# EasyEDA Pro project ProProject_Quadrotor_Mk2.epro, board PCB1
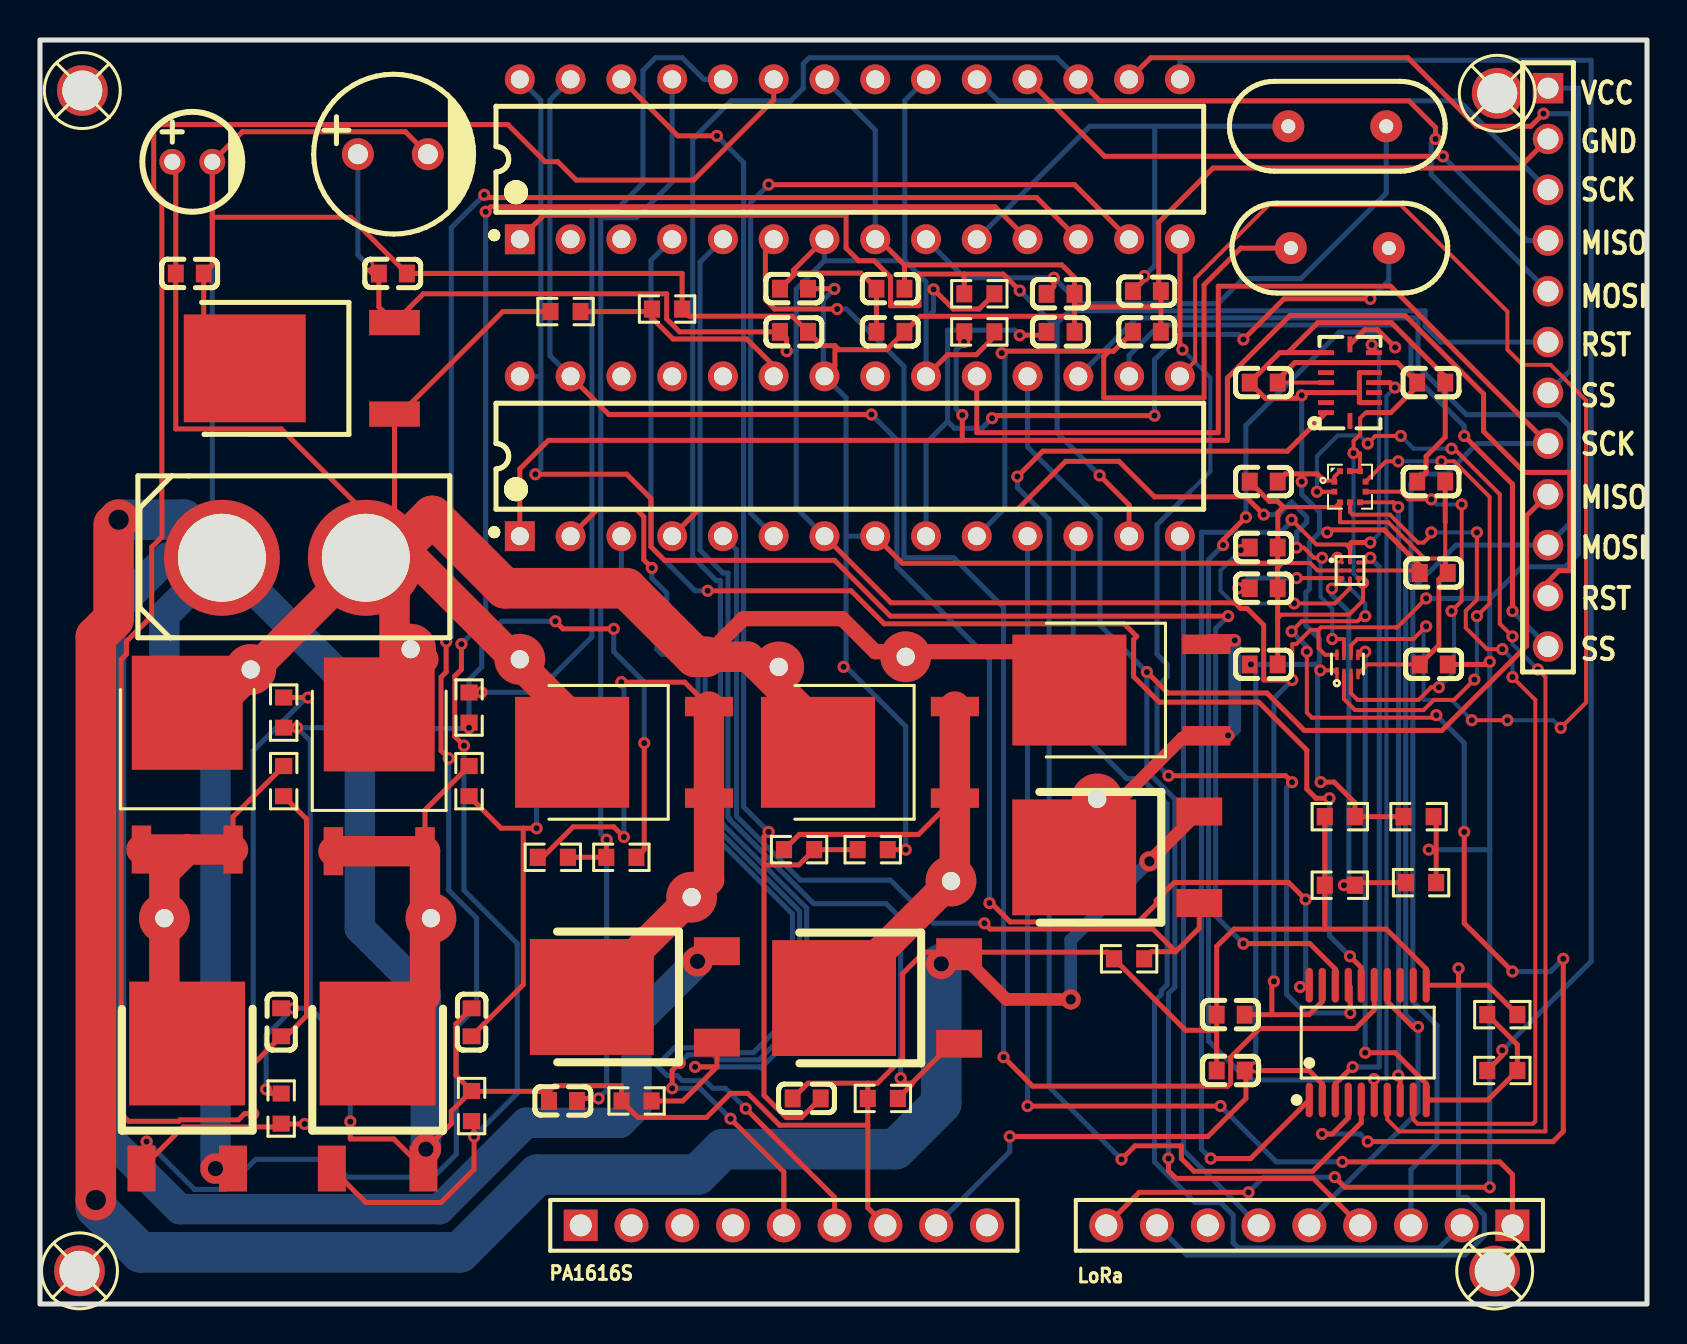
[diagram p3: board, top side]
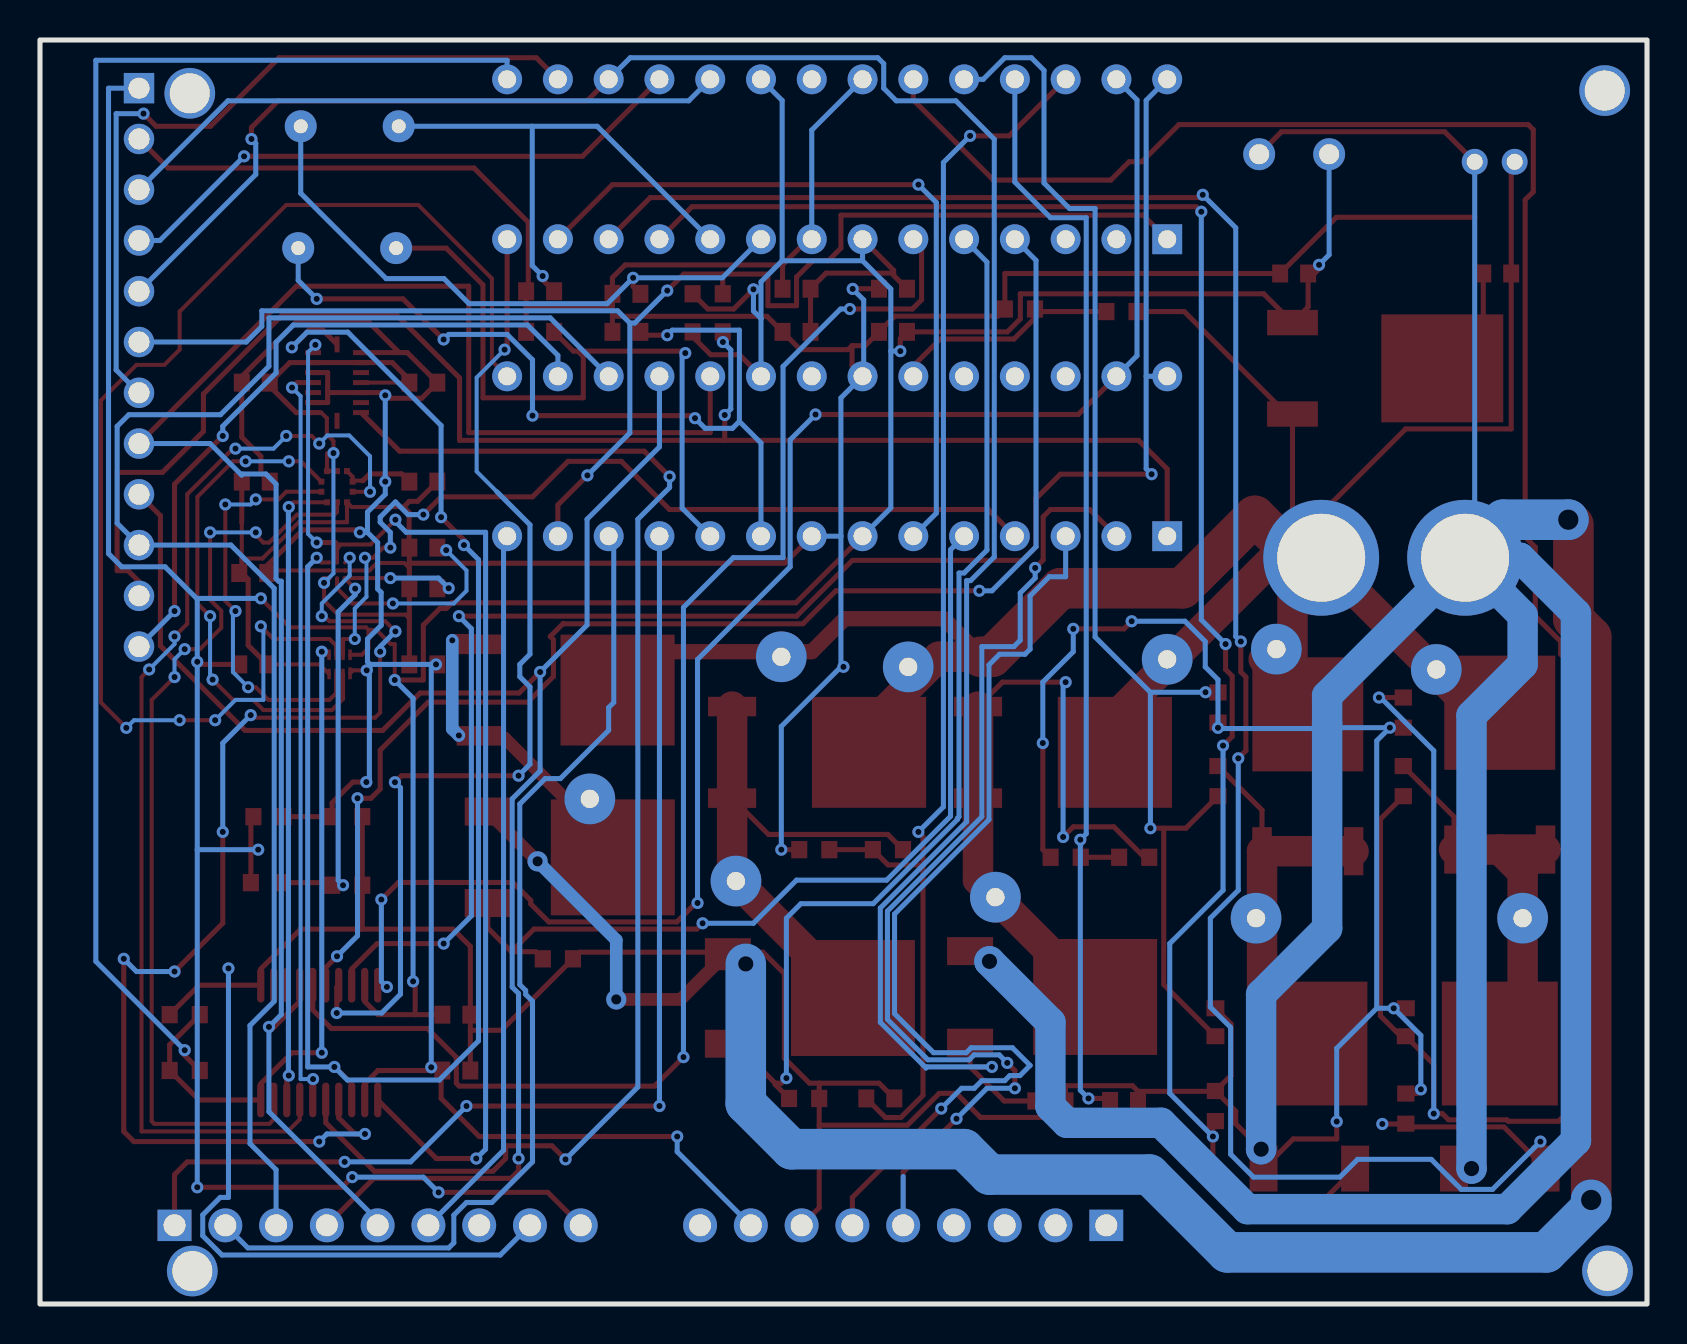
[diagram p4: board, bottom side, seen from below]

Outline 80.39 x 63.25 mm; copper layers: Top Layer, Bottom Layer. Coordinates in mm from the lower left corner of the outline.
Outline path: rectangle 0,63.25 80.39,0
Stack: Top Layer 0.035mm / Dielectric1 1.51mm FR4 er 4.5 / Bottom Layer 0.035mm

## Design rules (mm)
template: JLCPCB Capability(Two Layers Board)
spacing copperThickness1oz (default): track to track 0.102, other pairs 0.152 to 0.3
spacing copperThickness2oz: track to track 0.203, other pairs 0.152 to 0.3
track width copperThickness1oz (default): min 0.127, default 0.254, max 2.54
track width copperThickness2oz: min 0.203, default 0.254, max 2.54
differential pair differentialPair (default): width min 0.127, default 0.254, max 2.54; gap min 0.152, default 0.152
via viaSize (default): diameter min 0.5, default 0.61, max 10; hole min 0.3, default 0.305, max 6.3

## Placement (name value [footprint] x y rotation side)
5V_DC  100nF  [C0603]  17.65 51.56 0 top
12V_DC  100nF  [C0603]  7.49 51.56 0 top
BMI_DC1  100nF  [C0603]  69.6 46.1 0 top
BMI_DC2  100nF  [C0603]  61.21 46.1 0 top
BMM_CRST  2.2uF  [C0603]  61.21 37.85 0 top
BMM_DC1  100nF  [C0603]  61.21 35.81 0 top
BMM_DC2  100nF  [C0603]  69.72 36.58 0 top
C11  2.2uF  [CAP-TH_BD5.0-P2.00-D0.8-FD]  7.62 57.15 0 top
C14  100uF  [CAP-TH_BD8.0-P3.50-D0.6-FD]  17.65 57.53 0 top
C42  100nF  [C0603]  61.21 41.15 0 top
C43  100nF  [C0603]  69.6 41.15 0 top
C_LP1  100nF  [C0603]  12.07 14.1 270 top
C_LP2  100nF  [C0603]  21.59 14.1 270 top
C_LP3  100nF  [C0603]  26.16 10.16 0 top
C_LP4  100nF  [C0603]  38.35 10.29 0 top
D_1  MBR30100DT  [TO-252-2_L6.6-W6.1-P4.58-LS9.9-BR]  7.37 26.16 270 top
D_2  MBR30100DT  [TO-252-2_L6.6-W6.1-P4.58-LS9.9-BR]  16.97 26.08 270 top
D_3  MBR30100DT  [TO-252-2_L6.6-W6.1-P4.58-LS9.9-BR]  30.04 27.6 0 top
D_4  MBR30100DT  [TO-252-2_L6.6-W6.1-P4.58-LS9.9-BR]  42.34 27.6 0 top
D_5  MBR30100DT  [TO-252-2_L6.6-W6.1-P4.58-LS9.9-BR]  54.92 30.72 0 top
H1  -  [HDR-TH_12P-P2.54-V-M]  75.44 46.86 270 top
LoRa  -  [HDR-TH_9P-P2.54-V-F-1]  63.5 3.94 180 top
LS1_DC1  100nF  [C0603]  59.56 14.48 0 top
LS1_DC2  100nF  [C0603]  59.56 11.68 0 top
LS2_DC1  100nF  [C0603]  69.72 32 0 top
LS2_DC2  100nF  [C0603]  61.21 32 0 top
MCU1_DC1  100nF  [C0603]  37.72 50.8 0 top
MCU1_DC2  100nF  [C0603]  42.55 50.8 0 top
MCU1_RSTPU  10K  [R0603]  46.99 50.55 0 top
MCU2_DC1  100nF  [C0603]  37.72 48.64 0 top
MCU2_DC2  100nF  [C0603]  42.55 48.64 0 top
MCU2_RSTPU  10K  [R0603]  46.99 48.64 0 top
NOREF  -  [Pad_e655]  36.96 31.88 0 top
NOREF#2  -  [Pad_e205]  10.54 31.75 0 top
NOREF#3  -  [Pad_e184]  19.56 19.3 0 top
NOREF#4  -  [Pad_e1121]  43.31 32.39 0 top
NOREF#5  -  [Pad_e332]  32.6 20.36 0 top
NOREF#6  -  [Pad_e75]  18.54 32.77 0 top
NOREF#7  -  [Pad_e260]  24 32.26 0 top
NOREF#8  -  [Pad_e669]  45.58 21.16 0 top
NOREF#9  -  [Pad_e212]  6.22 19.3 0 top
NOREF#10  -  [Pad_e1122]  52.89 25.27 0 top
OCS1_C1  22pF  [C0603]  51.05 50.55 0 top
OCS1_C2  22pF  [C0603]  55.37 50.67 0 top
OCS2_C1  22pF  [C0603]  51.05 48.64 0 top
OCS2_C2  22pF  [C0603]  55.37 48.64 0 top
PA1616S  -  [HDR-TH_9P-P2.54-V-F-1]  37.21 3.94 0 top
R_PD1  10K  [R0603]  12.07 9.78 270 top
R_PD2  10K  [R0603]  21.59 9.91 270 top
R_PD3  10K  [R0603]  29.85 10.16 0 top
R_PD4  10K  [R0603]  42.16 10.29 0 top
R_PD5  10K  [R0603]  54.48 17.27 0 top
R_VD11  15K  [R0603]  12.19 26.16 270 top
R_VD12  10K  [R0603]  12.19 29.59 270 top
R_VD21  15K  [R0603]  21.46 26.16 270 top
R_VD22  10K  [R0603]  21.46 29.84 270 top
R_VD31  15K  [R0603]  25.65 22.35 0 top
R_VD32  10K  [R0603]  29.08 22.35 0 top
R_VD41  15K  [R0603]  37.97 22.73 0 top
R_VD42  10K  [R0603]  41.66 22.73 0 top
R_VD_BAT  20K  [R0603]  26.29 49.66 0 top
R_VD_BAT1  10K  [R0603]  31.37 49.78 0 top
SCREW1  -  [screw-hole-m2]  1.98 1.66 0 top
SCREW2  -  [screw-hole-m2]  72.9 60.58 0 top
SCREW3  -  [screw-hole-m2]  2.12 60.72 0 top
SCREW4  -  [screw-hole-m2]  72.77 1.65 0 top
T_1  IRLR2908TRPBF  [TO-252-3_L6.5-W6.1-P4.58-LS9.9-BR]  7.37 9.91 270 top
T_2  IRLR2908TRPBF  [TO-252-3_L6.5-W6.1-P4.58-LS9.9-BR]  16.89 9.91 270 top
T_3  IRLR2908TRPBF  [TO-252-3_L6.5-W6.1-P4.58-LS9.9-BR]  30.73 15.37 0 top
T_4  IRLR2908TRPBF  [TO-252-3_L6.5-W6.1-P4.58-LS9.9-BR]  42.85 15.31 0 top
T_5  IRLR2908TRPBF  [TO-252-3_L6.5-W6.1-P4.58-LS9.9-BR]  54.86 22.35 0 top
U1  MCU 1  [DIP-28_L34.6-W7.3-P2.54-LS10.2-BL]  40.51 57.28 0 top
U3  BMI088  [LGA-16_L4.5-W3.0-P0.50-BL]  65.53 46.1 0 top
U4  XT60  [CONN-TH_XT60]  12.7 37.34 0 top
U9  L7805CDT-TR  [TO-252-3_L6.5-W5.8-P4.58-BL]  13.99 46.82 90 top
U14  TXS0108EPWR  [TSSOP-20_L6.5-W4.4-P0.65-LS6.4-BL]  66.42 13.08 0 top
U15  BMM350  [WLCSP-9_L1.3-W1.3-R3-C3-P0.40-TL]  65.53 36.7 0 top
U16  MCU 2  [DIP-28_L34.6-W7.3-P2.54-LS10.2-BL]  40.51 42.42 0 top
U17  BMP390L  [LGA-10_L2.0-W2.0-P0.50-TL_BMP390L]  65.53 40.89 0 top
U18  TXS0102DQER  [X2SON-8_L1.4-W1.0-P0.35-BL]  65.41 32 0 top
VD_1.8_2  600  [R0603]  65.02 20.95 0 top
VD_1.8V_1  1K  [R0603]  69.09 21.08 0 top
VD_3.33V_1  1K  [R0603]  68.96 24.38 0 top
VD_3.33V_2  2K  [R0603]  65.02 24.38 0 top
VD_OE_1  1K  [R0603]  73.15 11.68 0 top
VD_OE_2  2K  [R0603]  73.15 14.48 0 top
X1  -  [OSC-TH_L10.0-W4.5-P5.00]  64.9 58.93 270 top
X2  -  [OSC-TH_L10.0-W4.5-P5.00]  65.02 52.83 270 top

## Footprints (pads in the part's own frame, mm; a bottom-side part is the same pattern mirrored in y, then rotated)
C0603
  rect 0.8x0.9 smd: 1(-0.7,0) 2(0.7,0)
CAP-TH_BD5.0-P2.00-D0.8-FD
  round 1.3 hole 0.8: 1(-1,0) 2(1,0)
CAP-TH_BD8.0-P3.50-D0.6-FD
  round 1.6 hole 1: 1(-1.75,0) 2(1.75,0)
CONN-TH_XT60
  round 5.8 hole 4.4: 1(-3.6,0) 2(3.6,0)
DIP-28_L34.6-W7.3-P2.54-LS10.2-BL
  rect 1.5x1.5 hole 0.9: 1(-16.51,-4)
  round 1.5 hole 0.9: 2(-13.97,-4) 3(-11.43,-4) 4(-8.89,-4) 5(-6.35,-4) 6(-3.81,-4) 7(-1.27,-4) 8(1.27,-4) 9(3.81,-4) 10(6.35,-4) 11(8.89,-4) 12(11.43,-4) 13(13.97,-4) 14(16.51,-4) 15(16.51,4) 16(13.97,4) 17(11.43,4) 18(8.89,4) 19(6.35,4) 20(3.81,4) 21(1.27,4) 22(-1.27,4) 23(-3.81,4) 24(-6.35,4) 25(-8.89,4) 26(-11.43,4) 27(-13.97,4) 28(-16.51,4)
HDR-TH_9P-P2.54-V-F-1
  rect 1.7x1.575 hole 1.1: 1(-10.16,0)
  round 1.7 hole 1.1: 2(-7.62,0) 3(-5.08,0) 4(-2.54,0) 5(0,0) 6(2.54,0) 7(5.08,0) 8(7.62,0) 9(10.16,0)
HDR-TH_12P-P2.54-V-M
  rect 1.524x1.524 hole 1.05: 1(-13.97,0)
  round 1.524 hole 1.05: 2(-11.43,0) 3(-8.89,0) 4(-6.35,0) 5(-3.81,0) 6(-1.27,0) 7(1.27,0) 8(3.81,0) 9(6.35,0) 10(8.89,0) 11(11.43,0) 12(13.97,0)
LGA-10_L2.0-W2.0-P0.50-TL_BMP390L
  rect 0.3x0.3 smd: 1(-0.78,0.25) 2(-0.78,-0.25) 3(-0.5,-0.78) 4(0,-0.78) 5(0.5,-0.78) 6(0.78,-0.25) 7(0.78,0.25) 8(0.5,0.78) 9(0,0.78) 10(-0.5,0.78)
LGA-16_L4.5-W3.0-P0.50-BL
  rect 0.8x0.25 smd: 1(-1.2,-1.498) 2(-1.2,-0.998) 3(-1.2,-0.498) 4(-1.2,0.002) 5(-1.2,0.502) 6(-1.2,1.002) 7(-1.2,1.502) 9(1.2,1.502) 10(1.2,1.002) 11(1.2,0.502) 12(1.2,0.002) 13(1.2,-0.498) 14(1.2,-0.998) 15(1.2,-1.498)
  rect 0.25x0.8 smd: 8(0,1.915) 16(0,-1.915)
OSC-TH_L10.0-W4.5-P5.00
  round 1.6 hole 0.7: 1(0,2.45) 2(0,-2.45)
Pad_e75
  round 2.54 hole 0.914: 29(0,0)
Pad_e184
  round 2.54 hole 0.914: 30(0,0)
Pad_e205
  round 2.54 hole 0.914: 31(0,0)
Pad_e212
  round 2.54 hole 0.914: 32(0,0)
Pad_e260
  round 2.54 hole 0.914: 33(0,0)
Pad_e332
  round 2.54 hole 0.914: 34(0,0)
Pad_e655
  round 2.54 hole 0.914: 35(0,0)
Pad_e669
  round 2.54 hole 0.914: 36(0,0)
Pad_e1121
  round 2.54 hole 0.914: 37(0,0)
Pad_e1122
  round 2.54 hole 0.914: 38(0,0)
R0603
  rect 0.806x0.864 smd: 1(-0.753,0) 2(0.753,0)
screw-hole-m2
  round 2.54 hole 2: 1(0,0)
TO-252-2_L6.6-W6.1-P4.58-LS9.9-BR
  rect 2.409x0.979 smd: 1(3.424,-2.29) 3(3.424,2.29)
  rect 5.711x5.548 smd: 2(-3.424,0)
TO-252-3_L6.5-W5.8-P4.58-BL
  rect 1.27x2.54 smd: 1(-2.288,-3.747) 3(2.288,-3.745)
  rect 5.4x6.1 smd: 2(-0.002,3.747)
TO-252-3_L6.5-W6.1-P4.58-LS9.9-BR
  rect 2.3x1.4 smd: 1(3.128,-2.29) 3(3.128,2.29)
  rect 6.2x5.8 smd: 2(-3.128,-0.004)
TSSOP-20_L6.5-W4.4-P0.65-LS6.4-BL
  oval 0.364x1.742 smd: 1(-2.925,-2.871) 2(-2.275,-2.871) 3(-1.625,-2.871) 4(-0.975,-2.871) 5(-0.325,-2.871) 6(0.325,-2.871) 7(0.975,-2.871) 8(1.625,-2.871) 9(2.275,-2.871) 10(2.925,-2.871) 11(2.925,2.871) 12(2.275,2.871) 13(1.625,2.871) 14(0.975,2.871) 15(0.325,2.871) 16(-0.325,2.871) 17(-0.975,2.871) 18(-1.625,2.871) 19(-2.275,2.871) 20(-2.925,2.871)
WLCSP-9_L1.3-W1.3-R3-C3-P0.40-TL
  round 0.2 smd: A1(-0.4,0.4) A2(0,0.4) A3(0.4,0.4) B1(-0.4,0) B2(0,0) B3(0.4,0) C1(-0.4,-0.4) C2(0,-0.4) C3(0.4,-0.4)
X2SON-8_L1.4-W1.0-P0.35-BL
  rect 0.175x0.6 smd: 1(-0.525,-0.445)
  rect 0.175x0.53 smd: 2(-0.175,-0.48) 3(0.175,-0.48) 4(0.525,-0.48) 5(0.525,0.48) 6(0.175,0.48) 7(-0.175,0.48) 8(-0.525,0.48)

## Nets
1.875V: BMM_DC1.1 U15.C1 VD_1.8_2.2 VD_1.8V_1.1
3.33V: BMI_DC1.2 BMI_DC2.1 BMM_DC2.1 C42.2 C43.1 LS1_DC2.2 LS2_DC2.1 PA1616S.8 U3.3 U3.7 U3.11 U3.14 U14.2 U15.B3 U17.1 U17.10 U18.1 VD_3.33V_1.1 VD_3.33V_2.2
5V: 5V_DC.1 C14.1 H1.1 LoRa.9 LS1_DC1.2 LS2_DC1.2 MCU1_DC1.1 MCU1_DC2.1 MCU1_RSTPU.2 MCU2_DC1.1 MCU2_DC2.1 MCU2_RSTPU.2 U1.7 U1.20 U9.3 U14.19 U16.7 U16.20 U18.8 VD_1.8V_1.2 VD_3.33V_1.2
12V: 12V_DC.1 C11.1 D_1.2 D_2.2 D_3.2 D_4.2 D_5.2 NOREF.35 NOREF#2.31 NOREF#4.37 NOREF#6.29 NOREF#7.33 R_VD_BAT.1 U4.2 U9.1
GND: 5V_DC.2 12V_DC.2 BMI_DC1.1 BMI_DC2.2 BMM_CRST.2 BMM_DC1.2 BMM_DC2.2 C11.2 C14.2 C42.1 C43.2 C_LP1.1 C_LP2.1 C_LP3.1 C_LP4.1 H1.2 LoRa.8 LS1_DC1.1 LS1_DC2.1 LS2_DC1.1 LS2_DC2.2 MCU1_DC1.2 MCU1_DC2.2 MCU2_DC1.2 MCU2_DC2.2 OCS1_C1.2 OCS1_C2.2 OCS2_C1.2 OCS2_C2.2 PA1616S.7 R_PD1.1 R_PD2.1 R_PD3.1 R_PD4.1 R_PD5.1 R_VD12.2 R_VD22.2 R_VD32.2 R_VD42.2 R_VD_BAT1.2 T_1.3 T_2.3 T_3.3 T_4.3 T_5.3 U1.8 U1.22 U3.4 U3.6 U3.10 U3.15 U4.1 U9.2 U14.11 U15.B1 U15.B2 U15.C3 U16.8 U16.22 U17.3 U17.8 U17.9 U18.4 VD_1.8_2.1 VD_3.33V_2.1 VD_OE_2.2
BEMF_1: C_LP1.2 R_VD11.2 R_VD12.1 U1.23
BEMF_2: C_LP2.2 R_VD21.2 R_VD22.1 U1.24
BEMF_3: C_LP3.2 R_VD31.2 R_VD32.1 U1.25
BEMF_4: C_LP4.2 R_VD41.2 R_VD42.1 U1.26
BMI_A_INT_3.33V: U3.1 U14.5
BMI_A_INT_5V: U1.4 U14.16
BMI_G_INT_3.33V: U3.12 U14.6
BMI_G_INT_5V: U1.6 U14.15
BMM_INT_3.33V: U14.4 U15.A1
BMM_INT_5V: U1.14 U14.17
BMP_CS_3.33V: U17.6 U18.3
BMP_CS_5V: U16.15 U18.6
BMP_INT_3.33V: U17.7 U18.2
BMP_INT_5V: U16.4 U18.7
LORA_CS: LoRa.2 U16.12
LORA_GO: LoRa.6 U16.14
LORA_RST: LoRa.1 U16.11
MCU2RX_GPSTX: PA1616S.5 U16.2
MCU2TX_GPSRX: PA1616S.6 U16.3
MISO_3.33V: U14.8 U17.5
MISO_MCU1: H1.4 U1.18
MISO_MCU2: H1.9 LoRa.4 U16.18
MOSI_3.33V: U14.9 U17.4
MOSI_MCU2: H1.10 LoRa.3 U16.17
OE_3.33V: U14.10 U18.5 VD_OE_1.2 VD_OE_2.1
OE_5V: U1.15 VD_OE_1.1
PWM_FAN: R_PD5.2 T_5.1 U16.5
PWM_T1: R_PD1.2 T_1.1 U1.12
PWM_T2: R_PD2.2 T_2.1 U1.11
PWM_T3/MOSI: H1.5 R_PD3.2 T_3.1 U1.17
PWM_T4: R_PD4.2 T_4.1 U1.5
RST_MCU1: H1.6 MCU1_RSTPU.1 U1.1 U16.13
RST_MCU2: H1.11 MCU2_RSTPU.1 U16.1
SCK_3.33V: U14.7 U17.2
SCK_MCU1: H1.3 U1.19
SCK_MCU2: H1.8 LoRa.5 U14.14 U16.19
SCL_3.33V: U3.8 U14.3 U15.A3
SCL_5V: U1.28 U14.18 U16.28
SDA_3.33V: U3.9 U14.1 U15.A2
SDA_5V: U1.27 U14.20 U16.27
SS_MCU1: H1.7 U1.16
SS_MCU2: H1.12 U16.16
START: U1.13 U16.6
VD_BATTERY: R_VD_BAT.2 R_VD_BAT1.1 U16.23
$1N565: D_1.1 D_1.3 NOREF#9.32 R_VD11.1 T_1.2
$1N1007: D_2.1 D_2.3 NOREF#3.30 R_VD21.1 T_2.2
$1N1195: D_3.1 D_3.3 NOREF#5.34 R_VD31.1 T_3.2
$1N1383: D_4.1 D_4.3 NOREF#8.36 R_VD41.1 T_4.2
$1N8442: OCS1_C2.1 U1.10 X1.2
$1N8453: OCS1_C1.1 U1.9 X1.1
$1N8901: OCS2_C2.1 U16.10 X2.2
$1N8903: OCS2_C1.1 U16.9 X2.1
$1N12852: BMM_CRST.1 U15.C2
$1N22123: D_5.1 D_5.3 NOREF#10.38 T_5.2

Pads without a net: LoRa 7; PA1616S 1 2 3 4 9; SCREW1 1; SCREW2 1; SCREW3 1; SCREW4 1; U1 2 3 21; U3 2 5 13 16; U14 12 13; U16 21 24 25 26

## Via types
v1: diameter 0.61, hole 0.305, Top Layer to Bottom Layer, 162 vias
v2: diameter 1.016, hole 0.508, Top Layer to Bottom Layer, 2 vias
v3: diameter 1.524, hole 0.762, Top Layer to Bottom Layer, 4 vias
v4: diameter 2.032, hole 1.016, Top Layer to Bottom Layer, 2 vias

## Routing (per net, layer and track width the routed paths; a pad name or vN(x,y) marks a point on that pad's centre or on a via; arc(x,y) is an arc through that point)
1.875V: length 25.1
  Top Layer w0.203: v1(62.86,36.32) 65.09,36.32 65.12,36.29 v1(64.63,35.8)
  Top Layer w0.254: 65.13,36.3 65.12,36.3 65.12,36.29 ; v1(59.95,35.81) 60.51,35.81 ; VD_1.8V_1.1 65.9,21.08 VD_1.8_2.2 v1(65.23,20.95)
  Bottom Layer w0.254: v1(64.63,35.8) 64.63,35.48 65.48,34.63 65.48,21.2 v1(65.23,20.95) ; v1(62.86,36.32) 60.45,36.32 v1(59.95,35.81)
3.33V: length 117.3
  Top Layer w0.203: U17.10 64.75,41.39 U17.1 64.7,41.2 64.26,41.2 ; 69.02,36.7 U15.B3 ; v1(64.05,31.71) 64.73,31.71 U18.1
  Top Layer w0.254: 62.42,47.6 62.02,47.6 60.51,46.1 61.3,45.32 62.84,45.32 63.12,45.6 ; 62.42,47.6 63.92,49.1 67.6,49.1 70.3,46.41 BMI_DC1.2 70.3,43.37 69.34,42.42 69.34,41.59 C43.1 ; 62.42,47.6 U3.7 ; 60.82,11.68 63.48,11.68 64.15,11.02 U14.2 ; 60.82,11.68 v1(60.82,11.84) ; 60.82,11.68 LS1_DC2.2 60.33,11.62 60.33,10.29 58.42,8.38 v1(48.51,8.38) ; C42.2 62.3,41.53 63.89,41.53 64.23,41.2 64.26,41.2 ; v1(64.07,26.12) 64.74,26.12 65.78,25.08 VD_3.33V_2.2 VD_3.33V_1.1 ; v1(63.12,45.47) 63.12,45.6 ; 63.12,45.6 63.12,45.6 U3.3 66,45.6 ; 66,45.6 66,45.1 66.73,45.1 ; 66,45.6 66,46.6 66.73,46.6 ; BMM_DC2.1 69.02,36.95 67.24,38.73 64.52,38.73 v1(64.39,38.61) ; v1(60.58,32) 60.51,32
  Bottom Layer w0.254: v1(64.39,38.61) 64.01,38.61 ; 64.01,38.61 64.01,39.62 63.12,40.51 v1(63.12,41.15) v1(63.12,45.47) ; 64.01,38.61 63.5,38.1 63.5,35.78 63.32,35.6 63.32,33.96 64.01,33.27 64.01,32.13 63.88,32 ; 63.88,32 63.88,31.74 63.91,31.71 ; 63.88,32 60.82,32 ; 60.82,32 v1(60.82,11.84) ; 60.82,32 v1(60.58,32) ; v1(48.51,8.38) 48.51,7.62 PA1616S.8 ; v1(64.07,26.12) 63.91,26.27 63.91,31.71 ; v1(64.05,31.71) 63.91,31.71
5V: length 241.9
  Top Layer w0.203: 63.96,33.73 63.96,32.82 64.29,32.48 64.88,32.48 ; 63.96,33.73 63.56,33.73 62.85,33.02 62.64,33.02 v1(62.64,31.22) ; 63.96,33.73 64.08,33.86 67.86,33.86 67.88,33.84 v1(69.34,35.31)
  Top Layer w0.254: v1(62.64,31.22) 61.21,31.22 61.21,33.97 60.39,34.8 60.07,34.8 59.78,35.09 42.57,35.09 U16.7 ; v1(16.41,51.99) 16.41,51.79 16.95,51.24 ; MCU1_DC1.1 37.69,51.47 37.69,51.58 ; v1(60.45,5.59) 54.99,5.59 LoRa.9 ; 37.69,51.58 41.06,51.58 MCU1_DC2.1 MCU2_DC2.1 ; 37.69,51.58 37.69,51.72 U1.7 ; 61.62,14.48 LS1_DC1.2 ; 61.62,14.48 61.62,16.04 v1(61.73,16.14) ; 61.62,14.48 63.48,14.48 64.15,15.14 U14.19 ; MCU1_RSTPU.2 46.98,49.78 45.69,49.78 v1(44.7,50.77) ; MCU2_RSTPU.2 47.74,48.4 46.84,47.5 45.4,47.5 U16.20 ; v1(72.52,32.13) 72.39,32 LS2_DC1.2 ; 69.84,22.73 VD_1.8V_1.2 ; 69.84,22.73 v1(69.47,22.73) ; 69.84,22.73 69.84,24.26 VD_3.33V_1.2 ; 16.95,51.24 16.95,49.89 U9.3 19.18,50.55 31.35,50.55 31.35,49.29 32,48.64 MCU2_DC1.1 37.35,48.31 v1(37.35,47.68) ; 16.95,51.24 5V_DC.1 ; v1(64.77,6.35) 65.28,5.84 v1(72.52,5.84)
  Bottom Layer w0.254: 39.24,52.2 37.83,50.79 37.83,47.68 ; 39.24,52.2 43.26,52.2 ; 39.24,52.2 U1.7 ; 37.83,47.68 v1(37.35,47.68) ; 37.83,47.68 37.83,39.83 U16.7 ; v1(60.45,5.59) 61.21,6.35 v1(64.77,6.35) ; 44.32,49.31 44.32,51.14 43.26,52.2 ; 44.32,49.31 44.7,49.69 v1(44.7,50.77) ; 44.32,49.31 U16.20 ; 43.26,52.2 43.26,60.22 U1.20 ; 72.52,22.73 v1(72.52,32.13) 72.52,35.28 ; 72.52,22.73 v1(69.47,22.73) ; 72.52,22.73 v1(72.52,5.84) ; 72.52,35.28 74.13,36.89 76.3,36.89 76.96,37.55 76.96,60.83 H1.1 ; 72.52,35.28 72.49,35.31 v1(69.34,35.31) ; C14.1 15.9,52.5 v1(16.41,51.99) ; v1(61.73,16.14) 61.73,30.3 v1(62.64,31.22)
12V: length 130.1
  Top Layer w0.254: 17.74,44.24 U9.1 ; 17.74,44.24 23.15,49.66 R_VD_BAT.1 ; 17.74,44.24 17.74,37.34 ; 17.35,38.39 17.35,38.5 12.07,43.78 6.79,43.78 12V_DC.1 6.79,56.98 C11.1
  Top Layer w0.762: 33.33,32.39 33.33,32.44 35.18,34.29 40.13,34.29 41.78,32.64 49.58,32.64 D_5.2
  Top Layer w1.524: D_2.2 17.74,30.27 17.74,30.31 ; 17.74,37.34 18.67,37.34 26.62,29.39 D_3.2 ; 17.74,37.34 16.3,37.34 8.55,29.59 D_1.2 ; 17.74,37.34 17.74,30.31 ; 17.74,30.31 18.67,31.24 18.42,31.5 19.18,32.26 ; D_4.2 38.92,28.9 35.43,32.39 33.33,32.39
  Top Layer w2.032: 17.74,37.55 19.62,39.43 23.24,35.81 29.34,35.81 32.77,32.39 33.33,32.39
GND: length 714.7
  Top Layer w0.203: v1(66.18,36.08) 66.18,35.19 65.48,34.49 62.11,34.49 61.91,34.3 ; U15.B2 63.91,36.7 63.54,37.08 62.17,37.08 61.91,36.82 ; U17.9 U17.8 66.03,42.58 ; 66.73,44.6 66.32,44.6 66.04,44.32 66.04,43.51 65.71,43.18 v1(65.71,42.58) ; 62.2,39.88 64.8,39.88 U17.3 65.03,39.12 67.45,39.12 69.26,37.3 70.3,37.3 70.3,39.12 ; LS2_DC1.1 66.41,32 U18.4 ; 61.91,46.25 62.06,46.1 U3.4 ; 61.91,39.51 61.92,39.52
  Top Layer w0.254: R_PD2.1 20.57,9.64 20.57,9.02 v3(19.3,7.75) ; R_PD2.1 20.81,11.44 20.81,14.02 C_LP2.1 ; R_PD2.1 21.61,10.64 25.46,10.64 ; VD_3.33V_2.1 VD_1.8_2.1 64.27,18.76 ; 58.86,13.7 LS1_DC1.1 58.86,17.89 59.73,18.76 64.27,18.76 ; 58.86,13.7 57.3,13.7 R_PD5.1 53.4,17.6 T_4.3 44.23,17.6 43.15,16.53 43.15,12.31 41.9,11.05 41.41,11.05 ; 58.86,13.7 LS1_DC2.1 ; v1(30.23,28.07) 30.23,22.74 R_VD32.2 ; 43.25,51.99 41.96,53.28 U1.8 ; 43.25,51.99 51.12,51.99 51.75,51.35 OCS1_C1.2 51.75,49.89 ; 43.25,51.99 MCU1_DC2.2 ; 70.3,36.58 BMM_DC2.2 ; 70.3,36.58 70.3,37.3 ; 70.3,36.58 69.98,36.26 69.98,32.96 LS2_DC1.1 ; PA1616S.7 41.41,4.82 41.41,8.95 ; 41.41,8.95 R_PD4.1 41.41,11.05 ; 41.41,8.95 37,8.95 35.41,10.54 34.54,10.54 33.34,9.34 29.91,9.34 R_PD3.1 29.09,10.92 25.74,10.92 25.46,10.64 ; 61.91,37.06 BMM_DC1.2 LS2_DC2.2 ; 61.91,37.06 43.14,37.06 U16.8 ; 61.91,37.06 BMM_CRST.2 61.92,37.86 61.92,39.5 61.91,39.51 ; 51.75,49.42 OCS2_C1.2 ; 51.75,49.42 51.75,49.89 ; 51.75,49.42 44.03,49.42 MCU2_DC2.2 42.36,47.75 39.97,47.75 39.77,47.95 ; U9.2 8.19,48.86 12V_DC.2 8.62,51.99 8.62,54.37 ; C43.2 70.3,39.12 ; 41.41,11.05 38.42,11.05 C_LP4.1 ; 25.46,10.16 25.46,10.64 ; v1(25.78,34.16) 26.16,33.78 v1(28.7,33.78) ; 64.27,18.76 67.35,18.76 69.35,16.76 U14.11 70.96,15.95 ; v1(39.74,50.79) 39.73,50.8 MCU1_DC1.2 ; T_2.3 17.7,8.26 15.52,8.26 v1(15.52,9.13) ; 56.07,48.64 56.07,49.89 ; 56.07,49.89 51.75,49.89 ; 56.07,49.89 56.07,50.67 55.96,50.78 55.96,54.12 58.68,56.84 73.99,56.84 H1.2 ; 39.77,47.95 39.11,47.95 MCU2_DC1.2 37.63,49.43 32.48,49.43 R_VD_BAT1.2 32.12,51.56 5V_DC.2 15.54,54.37 8.62,54.37 ; 39.77,47.95 39.77,46.94 U16.22 ; v1(43.31,22.73) R_VD42.2 ; 8.62,54.37 C11.2 10.13,58.66 18.28,58.66 C14.2 ; C_LP1.1 v1(12.67,14.8) ; 60.51,41.15 61.5,40.16 61.91,40.16 62.2,39.88 61.92,39.6 61.92,39.52 ; 70.96,15.95 v1(70.96,16.79) ; 70.96,15.95 72.43,15.95 VD_OE_2.2 ; v1(12.86,28.84) R_VD12.2 ; v1(66.18,36.08) 66.18,36.3 U15.C3 ; v1(11.31,10.74) 11.52,10.53 R_PD1.1 ; 66.73,44.6 67.58,44.6 68.9,45.92 BMI_DC1.1 67.89,47.1 U3.6 62.77,47.1 61.91,46.25 BMI_DC2.2
  Top Layer w0.635: v3(45.08,17.02) 46.57,17.02 48.34,15.24 v2(51.56,15.24) ; T_5.3 v2(55.5,22.15)
  Top Layer w2.032: v4(2.79,5.21) 2.79,33.38 3.68,34.27 3.68,38.99
  Bottom Layer w0.203: v1(65.71,42.58) 65.71,36.55 v1(66.18,36.08)
  Bottom Layer w0.254: v1(25.78,34.16) 23.11,34.16 22.1,33.15 22.1,31.88 21.46,31.24 v1(21.46,28.83) 21.43,28.8 16,28.8 ; v1(43.31,22.73) 43.31,28.9 40.32,31.88 ; U1.8 41.78,58.74 U1.22 ; LoRa.8 57.36,2.45 71.29,2.45 72.25,3.42 72.25,4.46 71.37,5.33 70.96,5.33 v1(70.96,16.79) ; 13.52,14.8 15.52,12.8 v1(15.52,9.13) ; 13.52,14.8 13.52,28.18 v1(12.86,28.84) 15.8,28.84 16,29.03 ; 13.52,14.8 v1(12.67,14.8) 11.31,13.44 v1(11.31,10.74) ; U4.1 8.62,37.82 C11.2 ; v1(28.7,33.78) 28.7,32.64 30.23,31.11 v1(30.23,28.07) ; 40.32,31.88 40.32,38.42 ; 40.32,31.88 v1(40.2,31.88) ; 40.32,38.42 40.32,45.34 U16.22 39.19,46.48 39.19,50.24 v1(39.74,50.79) ; 40.32,38.42 U16.8
  Bottom Layer w0.635: v2(55.5,22.15) 51.56,18.21 v2(51.56,15.24)
  Bottom Layer w1.524: U4.1 6.35,37.34 3.56,34.54 3.56,8.18 6.99,4.75 19.99,4.75 24.31,9.07 29.02,9.07 29.85,9.89 29.85,14.1 v3(32.89,17.14) ; U4.1 16,30.44 16,18.8 19.3,15.49 v3(19.3,7.75) ; U4.1 6.22,34.46 6.22,32 8.78,29.45 v3(8.78,6.78)
  Bottom Layer w2.032: v3(45.08,17.02) 45.08,10.03 42.8,7.75 34.16,7.75 32.89,6.48 24.89,6.48 21,2.59 5.03,2.59 2.79,4.83 v4(2.79,5.21) ; v4(3.94,39.24) 7.2,39.24 8.62,37.82
BEMF_1: length 133
  Top Layer w0.254: U1.23 36.7,60.25 32.69,56.24 26.82,56.24 25.9,57.15 25.27,57.15 23.41,59.01 5.94,59.01 5.69,58.76 5.69,55.65 6.1,55.25 6.1,38.38 5.59,37.87 5.59,34.42 4.32,33.15 4.32,32.52 4.06,32.26 4.06,9.52 4.44,9.14 6.94,9.14 7.01,9.22 9.93,9.22 10.24,9.53 v1(10.67,9.53) 10.67,12 C_LP1.2 12.31,13.4 13.34,14.42 13.34,24.27 R_VD11.2 ; v1(13.41,30.34) R_VD12.1
  Bottom Layer w0.254: v1(13.41,30.34) 13.33,30.34 10.67,27.68 v1(10.67,9.53)
BEMF_2: length 64.5
  Top Layer w0.254: 24.17,23.81 24.17,15.98 C_LP2.2 ; 24.17,23.81 v1(24.84,23.81) ; 24.17,23.81 23.07,23.81 R_VD21.2 ; v1(22.09,30.61) 21.47,30.61 R_VD22.1
  Bottom Layer w0.254: v1(24.84,23.81) 24.84,30.61 ; 24.84,30.61 27.61,33.38 27.61,54.81 28.89,54.81 30.16,56.09 30.16,61.72 30.8,62.36 32.13,62.36 33.21,61.28 U1.24 ; 24.84,30.61 v1(22.09,30.61)
BEMF_3: length 57.7
  Top Layer w0.254: C_LP3.2 26.99,10.29 v1(27.94,10.29) ; R_VD31.2 R_VD32.1 28.33,23.21 v1(28.35,23.23)
  Bottom Layer w0.254: U1.25 31.62,56.14 29.84,54.35 28.05,54.35 28.05,23.53 v1(28.35,23.23) 28.35,10.7 v1(27.94,10.29)
BEMF_4: length 63.8
  Top Layer w0.254: U1.26 31.91,58.45 v1(33.86,58.45) ; C_LP4.2 38.1,9.33 37.33,9.33 36.22,10.44 36.22,21.97 ; 36.22,21.97 37.96,21.97 R_VD41.2 R_VD42.1 ; 36.22,21.97 36.22,23.39 v1(36.45,23.62)
  Bottom Layer w0.254: v1(33.86,58.45) 35.2,57.11 35.2,24.87 v1(36.45,23.62)
BMI_A_INT_3.33V: length 68.4
  Top Layer w0.254: v1(48.89,41.4) 50.17,42.67 62.4,42.67 U3.1 ; v1(54.1,7.24) 54.78,7.92 57.1,7.92 57.1,7.28 57.73,6.64 63.67,6.64 66.1,9.07 U14.5
  Bottom Layer w0.254: v1(54.1,7.24) 50.48,10.86 50.48,39.26 48.89,40.85 v1(48.89,41.4)
BMI_A_INT_5V: length 67.5
  Top Layer w0.254: v1(64.51,25.31) 63.83,25.31 63.37,25.77 63.37,27.71 60.97,30.11 55.99,30.11 54.71,31.4 54.71,33.24 54.86,33.4 54.21,34.06 54.19,34.04 42.23,34.04 40.58,35.69 v1(33.4,35.69) ; U14.16 66.1,16.83 v1(65.53,17.4)
  Bottom Layer w0.254: v1(33.4,35.69) 32.77,35.69 30.56,37.89 30.56,52.22 U1.4 ; v1(64.51,25.31) 64.51,18.42 v1(65.53,17.4)
BMI_G_INT_3.33V: length 37.6
  Top Layer w0.254: 66.73,46.1 67.53,46.1 v1(67.78,45.85) ; v1(66.73,11.26) 66.75,11.24 U14.6
  Bottom Layer w0.203: v1(67.78,45.85) 67.36,45.43 67.36,11.26 v1(66.73,11.26)
BMI_G_INT_5V: length 72.3
  Top Layer w0.254: U1.6 36.29,52.86 36.29,50.25 36.75,49.78 v1(39.88,49.78) ; U14.15 66.75,14.72 65.82,13.79 61.01,13.79 59.56,12.35 59.56,11.05 59.42,10.9 49.65,10.9 v1(48.2,12.35)
  Bottom Layer w0.254: v1(39.88,49.78) 40.34,49.78 43.22,46.91 43.22,37.34 45.71,37.34 48.2,34.85 v1(48.2,12.35)
BMM_INT_3.33V: length 59.3
  Top Layer w0.203: v1(62.61,33.66) 63.12,34.16 65.91,34.16 66.17,34.42 v1(66.29,34.42) ; v1(69.85,29.46) 69.72,29.34 63.63,29.34 63.37,29.59 v1(63.37,32.64)
  Top Layer w0.254: v1(64.14,8.51) 64.64,8.51 65.45,9.31 U14.4 ; v1(73.66,16.64) 71.25,19.05 v1(71.25,23.62) ; v1(76.2,17.27) 76.2,8.64 75.69,8.13 v1(66.42,8.13)
  Bottom Layer w0.203: v1(64.9,37.34) 64.9,36.45 66.29,35.05 v1(66.29,34.42)
  Bottom Layer w0.254: v1(63.37,32.64) 63.37,32.89 v1(62.61,33.66) ; v1(73.66,16.64) 75.57,16.64 v1(76.2,17.27) ; v1(64.14,8.51) 66.04,8.51 v1(66.42,8.13) ; v1(69.85,29.46) 71.25,28.07 v1(71.25,23.62)
BMM_INT_5V: length 51.3
  Top Layer w0.254: v1(57.15,47.75) 57.15,47.88 57.02,48.01 U1.14 ; v1(56.45,26.43) 62.31,26.43 v1(62.63,26.11) ; U14.17 65.55,15.85 v1(65.55,14.56)
  Bottom Layer w0.203: 57.53,40.64 58.55,41.66 58.55,46.36 v1(57.15,47.75)
  Bottom Layer w0.254: v1(65.55,14.56) 63.3,14.56 62.36,15.5 62.36,25.83 v1(62.63,26.11) ; 57.53,40.64 55.88,38.99 55.88,32.51 56.39,32 56.39,31.39 55.88,30.88 55.88,27 v1(56.45,26.43)
BMP_CS_3.33V: length 20.4
  Top Layer w0.203: v1(71.12,40) 71.12,35.18 v1(70.61,34.67) ; v1(69.98,30.86) 69.6,30.86 68.96,30.23 65.91,30.23 65.58,30.56 U18.3 ; v1(69.6,40.26) 68.45,40.26 68.07,40.64 U17.6
  Bottom Layer w0.203: 70.74,34.54 70.74,31.62 v1(69.98,30.86) ; v1(69.6,40.26) 69.85,40 v1(71.12,40)
BMP_CS_5V: length 64.2
  Top Layer w0.203: U16.15 57.79,47.18 57.79,51.31 61.47,54.99 68.07,54.99 73.41,49.66 73.41,47.75 74.17,46.99 75.57,46.99 77.34,45.21 77.34,30.1 v1(76.07,28.83) ; v1(73.41,29.21) v1(71.63,29.21) ; v1(69.34,33.91) 68.71,33.27 65.91,33.27 65.58,32.95 65.58,32.48
  Bottom Layer w0.203: v1(76.07,28.83) 75.69,29.21 v1(73.41,29.21) ; v1(69.34,33.91) 69.22,33.78 69.22,30.23 70.61,30.23 v1(71.63,29.21)
BMP_INT_3.33V: length 25.5
  Top Layer w0.203: v1(71.88,34.42) 72.52,35.05 72.52,40.39 70.74,42.16 v1(70.1,42.16) ; v1(71.76,31.24) 70.74,30.23 69.72,30.23 69.22,29.72 65.79,29.72 65.23,30.27 U18.2 ; U17.7 67.33,42.16 v1(67.95,42.16)
  Bottom Layer w0.203: v1(71.88,34.42) 71.88,31.37 v1(71.76,31.24) ; v1(70.1,42.16) v1(67.95,42.16)
BMP_INT_5V: length 43.9
  Top Layer w0.203: v1(64.14,37.34) 63.73,37.34 63.22,37.85 v1(62.86,37.85) ; 65.23,32.48 65.23,33.27 v1(64.64,33.27)
  Top Layer w0.254: v1(61.21,39.5) 60.33,40.39 55.75,40.39 53.98,42.16 51.31,42.16 48.89,39.75 32.96,39.75 U16.4
  Bottom Layer w0.203: v1(64.64,33.27) 64.64,34.8 64.06,35.38 64.06,37.26 v1(64.14,37.34)
  Bottom Layer w0.254: v1(61.21,39.5) 61.98,39.5 62.61,40.13 63.37,39.37 63.37,39.12 62.86,38.61 v1(62.86,37.85)
LORA_CS: length 52.1
  Bottom Layer w0.254: U16.12 51.69,38.16 51.69,30.1 51.94,29.84 51.94,28.71 54.36,26.29 55.12,26.29 56.39,25.02 56.39,15.98 56.1,15.69 56.1,15.49 55.75,15.15 55.75,7.11 57.79,5.08 59.05,5.08 59.69,4.44 59.69,3.06 59.94,2.81 69.99,2.81 70.87,3.69
LORA_GO: length 36.1
  Bottom Layer w0.254: LoRa.6 57.2,7.69 57.2,38.24 U16.14
LORA_RST: length 56.7
  Top Layer w0.254: v1(65.15,7.11) 73.03,7.11 73.66,6.48 LoRa.1 ; v1(49.4,9.91) v1(59.05,9.91)
  Bottom Layer w0.254: v1(49.4,9.91) U16.11 ; v1(59.05,9.91) 61.85,7.11 v1(65.15,7.11)
MCU2RX_GPSTX: length 54.5
  Top Layer w0.254: PA1616S.5 37.21,6.6 v1(34.54,9.27) ; U16.2 27.88,39.75 29.85,39.75 30.21,39.39 30.21,37.23 v1(30.61,36.83) ; v1(32,12.06) 31.62,11.68 v1(31.62,10.8)
  Bottom Layer w0.254: 37.21,6.38 PA1616S.5 ; v1(32,12.06) 32.41,12.47 33.66,12.47 33.91,12.22 35.97,12.22 38,14.24 38,19.66 33.27,24.38 33.27,32.89 31.67,32.89 31.35,33.21 31.35,35.58 30.61,36.32 30.61,36.7 ; v1(34.54,9.27) 33.02,10.8 v1(31.62,10.8)
MCU2TX_GPSRX: length 49.7
  Top Layer w0.254: v1(35.31,9.78) 39.75,5.33 PA1616S.6
  Bottom Layer w0.254: U16.3 29.08,36.39 29.9,36.39 30.86,35.43 30.86,32.77 31.11,32.51 32.39,32.51 32.92,31.98 32.92,24.24 37.64,19.51 37.64,14.53 35.69,12.58 34.06,12.58 33.81,12.82 31.75,12.82 30.86,11.94 31.37,11.43 31.88,11.43 32.13,11.18 33.27,11.18 33.66,10.8 34.29,10.8 v1(35.31,9.78)
MISO_3.33V: length 31.7
  Top Layer w0.203: U17.5 67.71,40.11 v1(67.95,39.88)
  Top Layer w0.254: U14.8 68.05,11.33 v1(67.95,11.43)
  Bottom Layer w0.254: v1(67.95,39.88) 67.96,39.86 67.96,11.45 v1(67.95,11.43)
MISO_MCU1: length 29.4
  Top Layer w0.254: U1.18 53.25,57.43 v1(70.18,57.43)
  Bottom Layer w0.254: H1.4 74.39,53.21 v1(70.18,57.43)
MISO_MCU2: length 83.6
  Top Layer w0.254: v1(56.45,7.28) 56.45,6.67 56.83,6.29 63.69,6.29 LoRa.4 ; v1(55.37,31.62) 56.42,30.57 61.38,30.57 63.25,28.7 70.14,28.7 74.37,32.93 74.37,39.44 H1.9
  Bottom Layer w0.254: v1(56.45,7.28) 56.45,15.54 56.77,15.86 56.77,25.27 55.37,26.67 v1(55.37,31.62) 53.02,33.97 53.02,39.26 49.4,42.89 U16.18
MOSI_3.33V: length 46.6
  Top Layer w0.203: v1(73.15,32.77) 72.39,32.77 71.32,33.83 71.32,34.68 71.88,35.24 v1(71.88,38.61) ; U17.4 65.53,39.62 65.66,39.5 67.53,39.5 68.93,38.1 69.22,38.1 69.6,38.48 v1(69.6,38.61) ; U14.9 68.7,9.24 68.92,9.02 74.68,9.02 74.8,9.14 74.8,30.23 v1(73.66,31.37)
  Bottom Layer w0.203: v1(73.15,32.77) 73.66,32.26 v1(73.66,31.37) ; v1(69.6,38.61) v1(71.88,38.61)
MOSI_MCU2: length 76.4
  Bottom Layer w0.254: U16.17 54.86,49.34 68.94,49.34 68.94,46.92 71.36,44.5 75.95,44.5 76.53,43.91 76.53,39.07 H1.10 70.84,37.97 68.67,35.81 68.67,15.14 69.89,13.94 69.89,8.03 68.58,6.72 LoRa.3
OE_3.33V: length 33.6
  Top Layer w0.203: v1(66.29,32.64) 66.14,32.48 65.93,32.48
  Top Layer w0.254: VD_OE_2.1 73.91,12.97 VD_OE_1.2 72.43,10.21 U14.10 69.35,11.02 67.79,12.57 v1(66.29,12.57)
  Bottom Layer w0.254: v1(66.29,32.64) v1(66.29,12.57)
OE_5V: length 74.2
  Top Layer w0.254: v1(73.15,12.7) 73.15,12.44 VD_OE_1.1
  Bottom Layer w0.254: U1.15 57.02,62.23 77.6,62.23 77.6,17.14 v1(73.15,12.7)
PWM_FAN: length 43.7
  Top Layer w0.254: R_PD5.2 55.59,17.63 56.81,17.63 ; 56.81,17.63 55.68,18.76 47.53,18.76 v1(47.24,19.05) ; 56.81,17.63 57.99,18.81 T_5.1
  Bottom Layer w0.254: v1(47.24,19.05) 44.7,19.05 42.55,21.21 38.04,21.21 34.84,24.4 34.84,37.74 U16.5
PWM_T1: length 108.8
  Top Layer w0.254: R_PD1.2 12.07,9.01 ; 12.07,9.01 11.92,8.86 7.16,8.86 5.33,7.04 ; 12.07,9.01 v1(13.24,9.01) ; 5.33,7.04 5.08,6.78 ; 5.33,7.04 v1(5.33,8.13) ; v1(20.32,33.15) 20.32,31.62 20.07,31.37 20.07,27.69 v1(20.45,27.31) ; v1(22.23,55.5) 22.36,55.36 49.86,55.36 U1.12
  Bottom Layer w0.254: v1(20.32,33.15) 20.57,33.4 20.57,53.85 v1(22.23,55.5) ; v1(5.33,8.13) 7.73,5.74 9.29,5.74 10.8,7.24 14.48,7.24 15.37,6.35 19.69,6.35 20.83,7.49 20.83,13.84 21.84,14.86 21.84,19.3 20.45,20.7 v1(20.45,27.31)
PWM_T2: length 88
  Top Layer w0.254: v1(21.21,27.94) 20.75,28.4 20.75,31.42 21.08,31.75 v1(21.08,33.02) ; U1.11 47.78,54.9 22.55,54.9 v1(22.3,54.65) ; T_2.1 16.3,5.08 20.07,5.08 21.72,6.73 v1(21.72,8.38) 21.72,9.03 R_PD2.2
  Bottom Layer w0.254: v1(21.72,8.38) 23.88,10.54 23.88,18.03 21.21,20.7 v1(21.21,27.94) ; v1(21.08,33.02) 22.3,34.23 v1(22.3,54.65)
PWM_T3/MOSI: length 111.2
  Top Layer w0.254: 33.86,11.86 32.16,10.16 R_PD3.2 ; 33.86,11.86 v1(32.77,11.86) ; 33.86,11.86 T_3.1 ; U1.17 53.02,60.2 68.48,60.2 69.81,58.87 v1(69.81,58.29)
  Bottom Layer w0.254: v1(32.77,11.86) 36.01,11.86 36.07,11.81 38.35,14.1 38.35,19.81 34.04,24.13 34.04,36.19 33.84,36.19 32.65,37.38 32.65,58.28 34.57,60.2 37.55,60.2 38.18,60.83 38.18,62.06 38.48,62.36 50.86,62.36 U1.17 ; v1(69.81,58.29) 69.6,58.07 69.6,56.52 H1.5
PWM_T4: length 53.8
  Top Layer w0.254: 43.61,11.05 43.61,10.98 R_PD4.2 ; 43.61,11.05 43.31,11.05 v1(43.05,11.3) ; 43.61,11.05 45.59,13.02 T_4.1
  Bottom Layer w0.254: U1.5 33.02,52.13 33.02,37.72 34.16,36.58 34.42,36.58 34.42,24.38 34.5,24.3 34.49,24.25 38.71,20.03 42.33,20.03 43.05,19.3 v1(43.05,11.3)
RST_MCU1: length 72.7
  Top Layer w0.254: 46.24,51.53 48.19,51.53 v1(49.01,50.71) ; 46.24,51.53 43.98,51.53 43.98,49.95 42.55,49.95 42.55,51.38 41.73,52.2 40.95,52.2 40.32,52.83 40.32,54.48 25.21,54.48 U1.1 ; 46.24,51.53 MCU1_RSTPU.1 ; U16.13 54.48,39.98 v1(53.01,41.46)
  Bottom Layer w0.254: 50.88,49.09 51.49,49.7 69.29,49.7 69.29,48.91 70.08,48.13 H1.6 ; 50.88,49.09 50.88,43.58 v1(53.01,41.46) ; 50.88,49.09 50.63,49.09 v1(49.01,50.71)
RST_MCU2: length 77.9
  Top Layer w0.254: U16.1 24,41.78 25.43,43.21 46.14,43.21 ; MCU2_RSTPU.1 46.24,48.14 v1(46.23,48.13) ; H1.11 75.44,36.15 75.98,36.69 76.53,36.69 76.53,41.61 74.27,41.61 72.21,43.66 72.21,45.53 68.29,49.46 62.52,49.46 59.4,46.34 59.4,43.21 46.14,43.21 ; 46.14,43.21 v1(46.14,44.48)
  Bottom Layer w0.254: v1(46.14,44.48) 45.83,44.78 45.83,47.74 v1(46.23,48.13)
SCK_3.33V: length 55.7
  Top Layer w0.203: v1(70.61,42.8) 70.74,42.8 73.03,40.51 73.03,34.04 v1(73.66,33.4) ; v1(74.93,31.75) 75.31,31.37 75.31,8.64 68,8.64 67.4,9.24 U14.7 ; v1(63.88,40.64) 64.75,40.64 U17.2 ; v1(68.07,43.43) 66.8,43.43 v1(66.42,43.05)
  Bottom Layer w0.203: v1(63.88,40.64) 63.88,42.42 64.92,43.46 66.01,43.46 v1(66.42,43.05) ; v1(68.07,43.43) 68.71,42.8 v1(70.61,42.8) ; v1(74.93,31.75) 73.66,33.02 v1(73.66,33.4)
SCK_MCU1: length 30.9
  Bottom Layer w0.254: U1.19 47.94,60.2 70.99,60.2 H1.3
SCK_MCU2: length 92.1
  Top Layer w0.254: H1.8 67.56,50.93 58.94,50.93 58.94,43.6 46.86,43.6 U16.19 ; v1(68.94,13.87) 68.67,13.87 67.4,15.14 U14.14
  Bottom Layer w0.254: H1.8 71.88,43.05 70.3,41.48 70.25,41.53 69.09,41.53 68.58,41.02 68.58,36.3 68.45,36.17 68.32,36.17 68.32,14.48 v1(68.94,13.87) 68.94,9.62 63.5,4.19
SCL_3.33V: length 82.2
  Top Layer w0.203: U15.A3 66.31,37.1 v1(66.55,37.34)
  Top Layer w0.254: U3.8 66.26,48.75 66.91,48.75 v1(67.79,47.87) ; v1(59.18,37.97) 59.18,38.23 v1(60.33,39.37) ; v1(65.67,11.86) 65.64,11.86 64.8,11.02 U14.3
  Bottom Layer w0.254: v1(59.18,37.97) 58.46,37.25 58.46,13.16 60.41,11.21 65.01,11.21 v1(65.67,11.86) 67,11.86 67,36.89 v1(66.55,37.34) ; v1(67.79,47.87) 67.03,48.63 65,48.63 60.33,43.96 v1(60.33,39.37)
SCL_5V: length 83.5
  Top Layer w0.254: v1(59.44,34.42) 42.55,34.42 39.75,37.21 31.24,37.21 30.56,37.89 30.56,40.3 29.35,41.52 v1(24.78,41.52) ; v1(60.2,18.03) 63.53,18.03 64.8,16.76 U14.18
  Bottom Layer w0.254: v1(24.78,41.52) 25.05,41.79 25.05,46.42 ; 25.05,46.42 25.05,60.22 U1.28 ; 25.05,46.42 U16.28 ; v1(59.44,34.42) 58.81,33.79 58.81,19.42 v1(60.2,18.03)
SDA_3.33V: length 58.6
  Top Layer w0.203: v1(62.61,39.24) 63.85,38 65.33,38 65.53,37.8 U15.A2
  Top Layer w0.254: 66.73,47.6 66.73,47.88 v1(66.62,47.99) ; v1(58.57,7.28) 60.57,7.28 U14.1 ; 65.53,37.8 65.53,38.02 65.61,38.1 v1(66.55,38.1)
  Bottom Layer w0.203: v1(66.62,47.99) 66.98,47.63 66.98,38.53 v1(66.55,38.1)
  Bottom Layer w0.254: v1(58.57,7.28) 58.1,7.75 58.1,38.61 62.07,38.61 62.61,39.15 v1(62.61,39.24)
SDA_5V: length 80.9
  Top Layer w0.254: U16.27 28.45,44.51 v1(41.59,44.51) ; v1(63.31,20.24) 62.46,21.09 56.74,21.09 55.84,20.19 55.84,20.02 54.94,19.12 48.53,19.12 47.58,20.07 v1(47.5,20.07) ; v1(63.04,15.86) 63.41,15.86 U14.20
  Bottom Layer w0.254: U1.27 25.51,60.25 25.51,47.45 U16.27 ; v1(63.04,15.86) 63.31,16.14 v1(63.31,20.24) ; v1(41.59,44.51) 42.86,43.24 42.86,36.88 47.5,32.25 v1(47.5,20.07)
SS_MCU1: length 38.7
  Top Layer w0.254: U1.16 55.56,62.36 68.43,62.36 71.86,58.93 74.58,58.93 v1(75.21,59.56)
  Bottom Layer w0.254: H1.7 76.58,46.74 76.58,59.56 v1(75.21,59.56)
SS_MCU2: length 34.2
  Top Layer w0.254: v1(73.66,34.67) 73.66,41.02 v1(71.25,43.43)
  Bottom Layer w0.254: U16.16 54.48,47.47 56,48.98 67.72,48.98 68.58,48.12 68.58,46.59 71.25,43.92 v1(71.25,43.43) ; v1(73.66,34.67) H1.12
START: length 37.6
  Top Layer w0.254: U1.13 51.75,56.01 v1(36.45,56.01)
  Bottom Layer w0.254: v1(36.45,56.01) 35.55,55.11 35.55,39.57 U16.6
VD_BATTERY: length 11.6
  Top Layer w0.254: U16.23 36.7,46.94 35.35,48.28 31.67,48.28 30.62,49.34 30.62,49.66 ; R_VD_BAT.2 30.62,49.66 ; 30.62,49.66 R_VD_BAT1.1
$1N565: length 20.5
  Top Layer w0.254: R_VD11.1 9.66,24.38 D_1.3
  Top Layer w1.524: T_1.2 6.22,14.17 NOREF#9.32 6.22,21.6 7.36,22.74 ; 7.36,22.74 5.08,22.74 ; 7.36,22.74 D_1.3
$1N1007: length 20.4
  Top Layer w0.254: D_2.3 19.26,24.71 R_VD21.1
  Top Layer w1.524: T_2.2 19.26,15.41 D_2.3 D_2.1
$1N1195: length 35.1
  Top Layer w0.254: v1(29.21,23.37) 28.7,23.88 26.67,23.88 24.9,22.11 R_VD31.1 ; D_3.3 32.25,31.11 v1(29.08,31.11)
  Top Layer w1.524: D_3.3 D_3.1 33.47,21.22 T_3.2
  Bottom Layer w0.254: v1(29.08,31.11) 29.21,30.99 v1(29.21,23.37)
$1N1383: length 26.7
  Top Layer w0.254: R_VD41.1 37.98,23.5 43.95,23.5 D_4.1
  Top Layer w1.524: 39.72,15.31 45.77,21.35 D_4.1 D_4.3
$1N8442: length 26.6
  Top Layer w0.254: v1(55.25,51.44) 55.25,51.25 OCS1_C2.1
  Bottom Layer w0.254: 55.76,58.93 52.51,58.93 U1.10 ; 55.76,58.93 55.76,51.95 v1(55.25,51.44) ; 55.76,58.93 X1.2
$1N8453: length 31
  Top Layer w0.254: 50.35,50.55 50.72,50.91 v1(50.72,51.35)
  Bottom Layer w0.254: X1.1 67.35,55.58 63.07,51.31 60.18,51.31 58.93,50.05 52.01,50.05 v1(50.72,51.35) 46.25,51.35 U1.9
$1N8901: length 35
  Top Layer w0.254: 62.57,52.83 60.07,52.83 58.23,50.99 58.23,45.34 53.21,45.34 53.21,47.41 53.48,47.68 ; OCS2_C2.1 53.71,47.68 53.48,47.68 ; 53.48,47.68 48.21,47.68 v1(48.11,47.58)
  Bottom Layer w0.254: v1(48.11,47.58) 48.27,47.42 48.27,39.82 U16.10
$1N8903: length 44.6
  Top Layer w0.254: v1(49.01,48.47) 50.19,48.47 50.35,48.64 ; v1(60.2,48.26) 62.23,50.29 v1(66.55,50.29) ; v1(55.75,44.45) 47.75,44.45 v1(47.63,44.32)
  Bottom Layer w0.254: X2.1 67.47,51.22 v1(66.55,50.29) ; U16.9 44.32,43.08 45.4,44.16 ; 45.4,44.16 45.4,48.73 48.76,48.73 v1(49.01,48.47) ; 45.4,44.16 45.75,43.81 47.12,43.81 v1(47.63,44.32) ; v1(55.75,44.45) 55.75,47.24 57.02,48.51 59.94,48.51 v1(60.2,48.26)
$1N12852: length 10
  Top Layer w0.203: U15.C2 65.53,35.81 64.77,35.05 v1(62.74,35.05)
  Bottom Layer w0.203: v1(62.74,35.05) 59.69,35.05 59.05,35.69 59.05,36.7 v1(60.07,37.72)
$1N22123: length 17
  Top Layer w0.635: v1(59.44,28.45) 59.31,28.32 57.15,28.32 51.74,22.91 T_5.2 ; v1(59.77,33.21) 58.54,33.21 D_5.3
  Bottom Layer w0.635: v1(59.77,33.21) 59.77,28.78 v1(59.44,28.45)

## Text on the board
Top Silkscreen Layer: VCC | GND | SCK | MISO | MOSI | RST | SS
